# EAGLE design BEP2_rev1 seeed 55x88 (EAGLE 6.5.0)
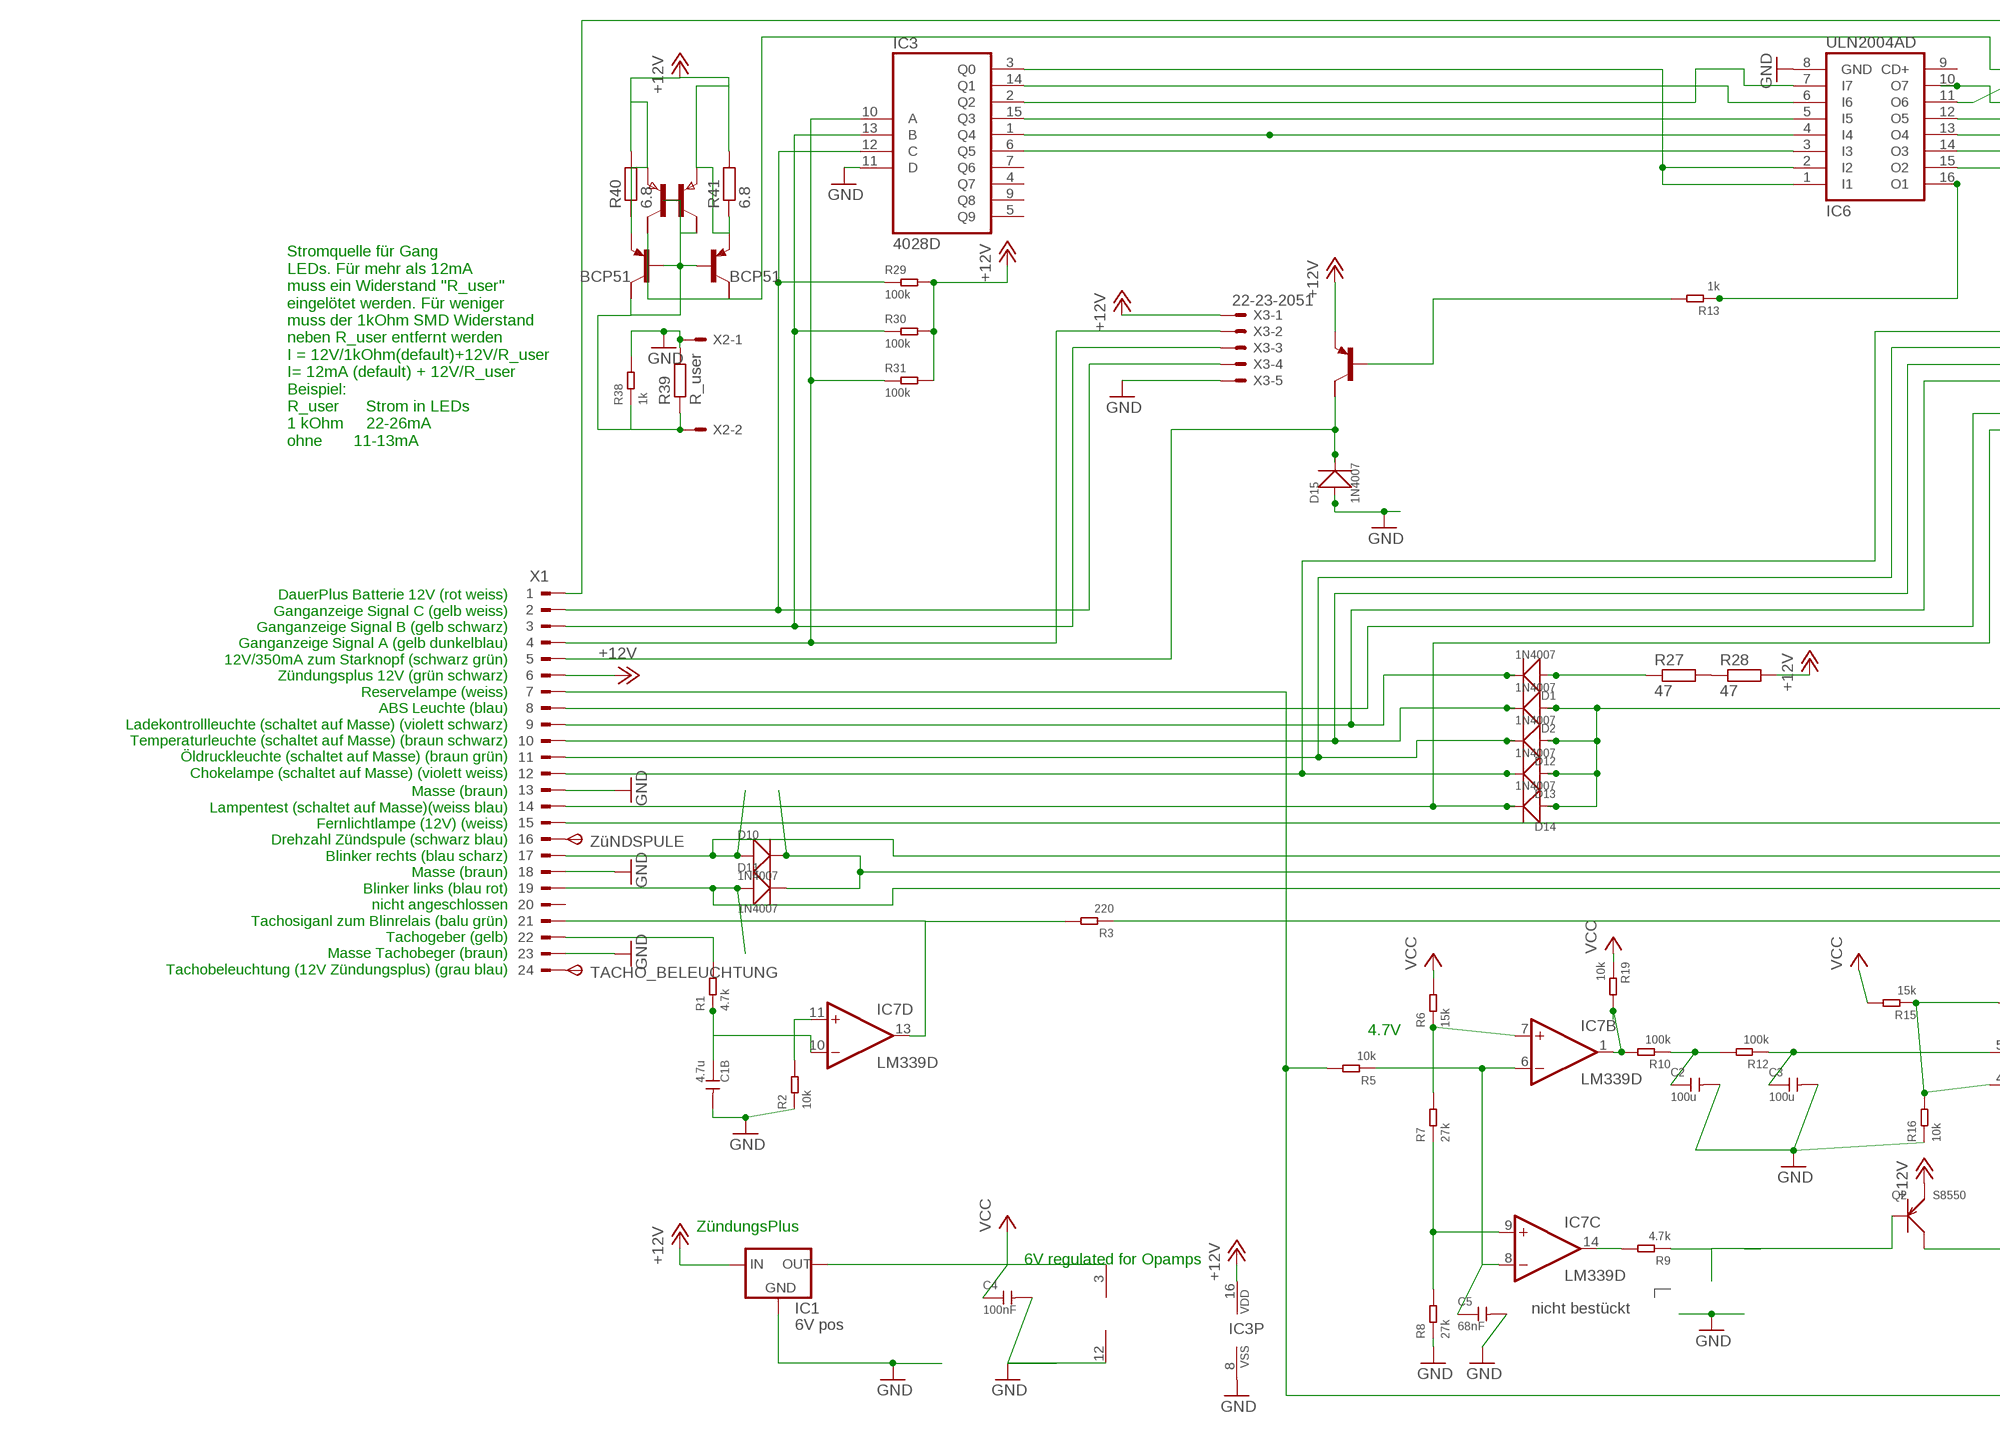
[diagram p0: schematic, sheet 1, part 1 of 2]
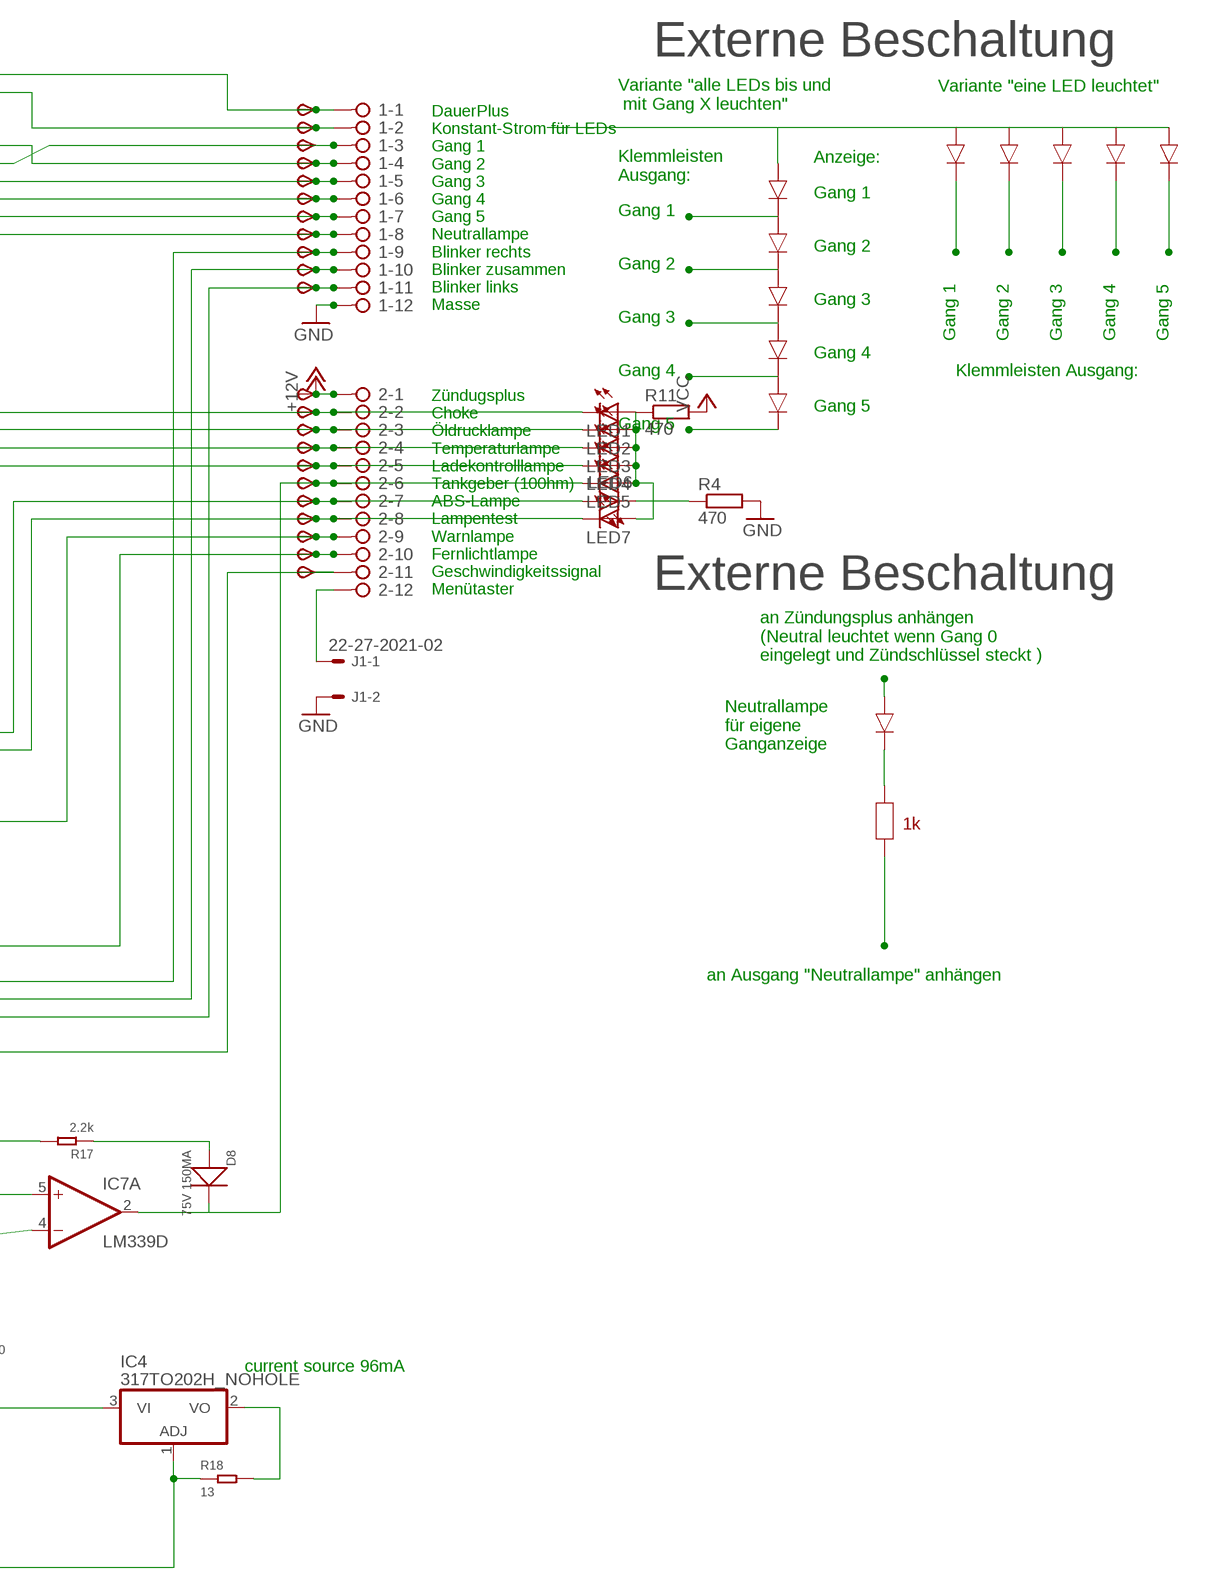
[diagram p1: schematic, sheet 1, part 2 of 2]

## Parts
1  2081-1132  [12-PIN]
2  2081-1132  [12-PIN]
C1B  4.7u  CERAMIC-4.7UF-25V-10%-X5R(0805)  [C0805]
C2  100u  CERAMIC-100UF-6.3V-20%-X5R(1206)  [C1206]
C3  100u  CERAMIC-100UF-6.3V-20%-X5R(1206)  [C1206]
C4  100nF  CERAMIC-100NF-50V-10%-X7R(0805)  [C0805]
C5  68nF  CERAMIC-100NF-50V-10%-X7R(0805)  [C0805]
D1  1N4007  DIODE-GEN-PURPOSE-1KV-1A(DO-214AC)  [DO-214AC]
D2  1N4007  DIODE-GEN-PURPOSE-1KV-1A(DO-214AC)  [DO-214AC]
D8  75V 150MA  SMD-DIODE-SWITCHING-75V-150MA(D1206)  [LED-1206]
D10  1N4007  DIODE-GEN-PURPOSE-1KV-1A(DO-214AC)  [DO-214AC]
D11  1N4007  DIODE-GEN-PURPOSE-1KV-1A(DO-214AC)  [DO-214AC]
D12  1N4007  DIODE-GEN-PURPOSE-1KV-1A(DO-214AC)  [DO-214AC]
D13  1N4007  DIODE-GEN-PURPOSE-1KV-1A(DO-214AC)  [DO-214AC]
D14  1N4007  DIODE-GEN-PURPOSE-1KV-1A(DO-214AC)  [DO-214AC]
D15  1N4007  DIODE-GEN-PURPOSE-1KV-1A(DO-214AC)  [DO-214AC]
IC1  6V pos  78LXX  [78LXX]
IC3  4028D  [SO16]
IC4  317TO202H_NOHOLE  [TO220H_NOHOLE]
IC6  ULN2004AD  [SO16]
IC7  LM339D  [SO14]
J1  22-27-2021-02  [6410-02]
LED1  LEDLD260  [LD260]
LED2  LEDLD260  [LD260]
LED3  LEDLD260  [LD260]
LED4  LEDLD260  [LD260]
LED5  LEDLD260  [LD260]
LED6  LEDLD260  [LD260]
LED7  LEDLD260  [LD260]
Q2  S8550  SMD-TRANSISTORS-PNP-25V-500MA-S8550(SOT-23)  [SOT-23]
Q3  BCP53T1  [SOT223]
R1  4.7k  SMD-RES-4.7K-5%-1/8W(0805)  [R0805]
R2  10k  SMD-RES-10K-1%-1/8W(0805)  [R0805]
R3  220  SMD-RES-220R-5%-1/8W(0805)  [R0805]
R4  470  R-EU_R0805  [R0805]
R5  10k  SMD-RES-10K-1%-1/8W(0805)  [R0805]
R6  15k  SMD-RES-10K-1%-1/8W(0805)  [R0805]
R7  27k  SMD-RES-18K-5%-1/10W(0603)  [R0603]
R8  27k  SMD-RES-18K-5%-1/10W(0603)  [R0603]
R9  4.7k  SMD-RES-4.7K-5%-1/8W(0805)  [R0805]
R10  100k  SMD-RES-100K-1%-1/10W(0603)  [R0603]
R11  470  R-EU_R0805  [R0805]
R12  100k  SMD-RES-100K-1%-1/10W(0603)  [R0603]
R13  1k  SMD-RES-1K-5%-1/8W(0805)  [R0805]
R15  15k  SMD-RES-15K-1%-1/10W(0603)  [R0603]
R16  10k  SMD-RES-10K-1%-1/8W(0805)  [R0805]
R17  2.2k  SMD-RES-2.2K-5%-1/8W(0805)  [R0805]
R18  13  SMD-RES-13R-5%-1/4W(1206)  [R1206]
R19  10k  SMD-RES-10K-1%-1/8W(0805)  [R0805]
R27  47  R-EU_V235/17_1MM  [V235/17_1MM]
R28  47  R-EU_V235/17_1MM  [V235/17_1MM]
R29  100k  SMD-RES-100K-1%-1/10W(0603)  [R0603]
R30  100k  SMD-RES-100K-1%-1/10W(0603)  [R0603]
R31  100k  SMD-RES-100K-1%-1/10W(0603)  [R0603]
R38  1k  SMD-RES-1K-5%-1/8W(0805)  [R0805]
R39  R_user  R-EU_R0805  [R0805]
R40  6.8  R-EU_R0805  [R0805]
R41  6.8  R-EU_R0805  [R0805]
T1  PNP2SM8  [SM8]
T13  BCP53T1  [SOT223]
T14  BCP53T1  [SOT223]
TACHO_BELEUCHTUNG  TPSP1_1MM  [P1_1.0MM]
TP1  TPSB1,27  [B1,27]
TP2  TPSB1,27  [B1,27]
TP3  TPSB1,27  [B1,27]
TP4  TPSB1,27  [B1,27]
TP5  TPSB1,27  [B1,27]
TP6  TPSB1,27  [B1,27]
TP7  TPSB1,27  [B1,27]
TP8  TPSB1,27  [B1,27]
TP9  TPSB1,27  [B1,27]
TP10  TPSB1,27  [B1,27]
TP11  TPSB1,27  [B1,27]
TP12  TPSB1,27  [B1,27]
TP16  TPSB1,27  [B1,27]
TP17  TPSB1,27  [B1,27]
TP18  TPSB1,27  [B1,27]
TP19  TPSB1,27  [B1,27]
TP21  TPSB1,27  [B1,27]
TP22  TPSB1,27  [B1,27]
TP23  TPSB1,27  [B1,27]
TP24  TPSB1,27  [B1,27]
TP25  TPSB1,27  [B1,27]
TP26  TPSB1,27  [B1,27]
X1  CON_BMW  [24-PIN]
X2  22-23-2021  [22-23-2021]
X3  22-23-2051  [22-23-2051]
ZüNDSPULE  TPSP1_1MM  [P1_1.0MM]

## Nets
+12V: 2.1 IC1.IN IC3.16(VDD) Q2.2(E) Q3.3(E) R28.2 R29.2 R30.2 R31.2 R40.1 R40.2 R41.1 R41.2 T1.1(B:E) T1.3(A:E) T13.3(E) T14.3(E) TP12.TP(PP) X1.6 X3.1
GND: 1.12 C1B.2 C2.2 C3.2 C4.2 C5.2 D15.1(+) IC1.GND IC3.8(VSS) IC3.11(D) IC6.8(GND) IC7.12(P:GND) J1.2 R2.1 R4.2 R8.1 R16.1 R38.2 R39.2 X1.13 X1.18 X1.23 X2.1 X3.5
N$1: 2.9 D2.1(+) D12.1(+) D13.1(+) D14.1(+) TP24.TP(PP)
N$2: IC3.10(A) R31.1 X1.4 X3.2
N$3: IC3.13(B) R30.1 X1.3 X3.3
N$4: 2.7 LED6.A TP22.TP(PP) X1.8
N$6: IC6.16(O1) R13.1
N$7: IC7.11(D:+IN) R2.2
N$8: R27.2 R28.1
N$11: D15.2(-) Q3.2(C) X1.5
N$12: 2.2 D13.2(-) LED1.K(C) TP16.TP(PP) X1.12
N$13: 2.3 D12.2(-) LED2.K(C) TP17.TP(PP) X1.11
N$14: 2.4 D2.2(-) LED3.K(C) TP18.TP(PP) X1.10
N$15: IC4.1(ADJ) R5.2 R18.1 X1.7
N$16: C5.1 IC7.6(B:-IN) IC7.8(C:-IN) R5.1
N$17: IC3.12(C) R29.1 X1.2 X3.4
N$18: IC3.15(Q3) IC6.5(I5)
N$19: 2.8 D14.2(-) LED7.K(C) TP23.TP(PP) X1.14
N$20: 1.9 D10.1(+) TP9.TP(PP) X1.17
N$21: 1.11 D11.1(+) TP11.TP(PP) X1.19
N$22: 1.10 D10.2(-) D11.2(-) TP10.TP(PP)
N$23: R1.2 X1.22
N$24: C1B.1 IC7.10(D:-IN) R1.1
N$25: 1.6 IC6.13(O4) TP6.TP(PP)
N$26: 1.7 IC6.14(O3) TP7.TP(PP)
N$27: 2.11 R3.1 TP26.TP(PP)
N$28: 2.12 J1.1
N$29: IC4.2(VO) R18.2
N$30: IC7.9(C:+IN) R7.1 R8.2
N$31: IC7.14(C:OUT) R9.2
N$34: LED6.K(C) R4.1
N$35: IC4.3(VI) Q2.3(C)
N$36: Q2.1(B) R9.1
N$37: IC3.2(Q2) IC6.7(I7)
N$38: 1.3 IC6.11(O6) TP3.TP(PP)
N$39: 1.5 IC6.12(O5) TP5.TP(PP)
N$40: IC7.7(B:+IN) R6.1 R7.2
N$41: LED1.A LED2.A LED3.A LED4.A LED5.A LED7.A R11.1
N$42: X1.16 ZüNDSPULE.TP(PP)
N$43: Q3.1(B) R13.2
N$44: IC3.3(Q0) IC6.1(I1) IC6.2(I2)
N$45: C2.1 R10.1 R12.2
N$46: C3.1 IC7.5(A:+IN) R12.1
N$47: IC7.4(A:-IN) R15.1 R16.2 R17.2
N$48: IC7.13(D:OUT) R3.2 X1.21
N$49: D8.+ R17.1
N$50: IC3.1(Q4) IC6.4(I4)
N$52: 1.8 IC6.15(O2) TP8.TP(PP)
N$53: 2.10 TP25.TP(PP) X1.15
N$54: D1.1(+) R27.1
N$55: 2.5 D1.2(-) LED4.K(C) TP19.TP(PP) X1.9
N$56: IC3.14(Q1) IC6.6(I6)
N$57: R38.1 R39.1 T1.2(B:B) T1.4(A:B) T1.6(A:C1) T13.1(B) T13.2(C) T14.1(B) X2.2
N$58: TACHO_BELEUCHTUNG.TP(PP) X1.24
N$59: 1.2 T1.8(B:C1) T14.2(C) TP2.TP(PP)
N$60: 2.6 D8.- IC7.2(A:OUT) LED5.K(C) TP21.TP(PP)
N$61: IC3.6(Q5) IC6.3(I3)
N$67: 1.4 IC6.10(O7) TP4.TP(PP)
N$69: 1.1 TP1.TP(PP) X1.1
N$580: IC7.1(B:OUT) R10.2 R19.2
VCC: C4.1 IC1.OUT IC7.3(P:V+) R6.2 R11.2 R15.2 R19.1
Unconnected: IC3.4(Q7) IC3.5(Q9) IC3.7(Q6) IC3.9(Q8) IC6.9(CD+) Q3.4(C/) T1.5(A:C) T1.7(B:C) T13.4(C/) T14.4(C/) X1.20

## Notes on the sheet
- Externe Beschaltung
- Variante "eine LED leuchtet"
- Variante "alle LEDs bis und
   mit Gang X leuchten"
- Anzeige:
- Klemmleisten
  Ausgang:
- Gang 1
- DauerPlus
  Konstant-Strom für LEDs
  Gang 1
  Gang 2
  Gang 3
  Gang 4
  Gang 5
  Neutrallampe
  Blinker rechts
  Blinker zusammen
  Blinker links
  Masse
- Gang 1
- Gang 2
- Gang 2
- Gang 3
- Gang 3
- Gang 1 | Gang 2 | Gang 3 | Gang 4 | Gang 5
- Gang 4
- Gang 4 | Klemmleisten Ausgang:
- Gang 5
- Gang 5
- Zündugsplus
  Choke
  Öldrucklampe
  Temperaturlampe
  Ladekontrolllampe
  Tankgeber (100hm)
  ABS-Lampe
  Lampentest
  Warnlampe
  Fernlichtlampe
  Geschwindigkeitssignal
  Menütaster
- Stromquelle für Gang
  LEDs. Für mehr als 12mA
  muss ein Widerstand "R_user"
  eingelötet werden. Für weniger
  muss der 1kOhm SMD Widerstand
  neben R_user entfernt werden
  I = 12V/1kOhm(default)+12V/R_user
  I= 12mA (default) + 12V/R_user
  Beispiel:
  R_user      Strom in LEDs
  1 kOhm     22-26mA
  ohne       11-13mA
- Externe Beschaltung
- an Zündungsplus anhängen
  (Neutral leuchtet wenn Gang 0
  eingelegt und Zündschlüssel steckt )
- Neutrallampe
  für eigene
  Ganganzeige
- DauerPlus Batterie 12V (rot weiss)
  Ganganzeige Signal C (gelb weiss)
  Ganganzeige Signal B (gelb schwarz)
  Ganganzeige Signal A (gelb dunkelblau)
  12V/350mA zum Starknopf (schwarz grün)
  Zündungsplus 12V (grün schwarz)
  Reservelampe (weiss)
  ABS Leuchte (blau)
  Ladekontrollleuchte (schaltet auf Masse) (violett schwarz)
  Temperaturleuchte (schaltet auf Masse) (braun schwarz)
  Öldruckleuchte (schaltet auf Masse) (braun grün)
  Chokelampe (schaltet auf Masse) (violett weiss)
- 1k
- an Ausgang "Neutrallampe" anhängen
- Masse (braun)
  Lampentest (schaltet auf Masse)(weiss blau)
  Fernlichtlampe (12V) (weiss)
  Drehzahl Zündspule (schwarz blau)
  Blinker rechts (blau scharz)
  Masse (braun)
  Blinker links (blau rot)
  nicht angeschlossen
  Tachosiganl zum Blinrelais (balu grün)
  Tachogeber (gelb)
  Masse Tachobeger (braun)
  Tachobeleuchtung (12V Zündungsplus) (grau blau)
- 4.7V
- current source 96mA
- ZündungsPlus
- 6V regulated for Opamps
- nicht bestückt

## Library data of the parts
1 2 = con WAGO BMW:2081-1132: WAGO SREW CLAMP
C1B = Seeed-Capacitor-2016:CERAMIC-4.7UF-25V-10%-X5R(0805): 302010146; MPN: CC0805KKX5R8BB475; VALUE: 4.7uf
C2 C3 = Seeed-Capacitor-2016:CERAMIC-100UF-6.3V-20%-X5R(1206): 302010183; MPN: GRM31CR60J107ME39L; VALUE: 100uf
C4 C5 = Seeed-Capacitor-2016:CERAMIC-100NF-50V-10%-X7R(0805): 302010165; MPN: CC0805KRX7R9BB104; VALUE: 100nf
D1 D2 D10-D15 = Seeed-Diode-2016:DIODE-GEN-PURPOSE-1KV-1A(DO-214AC): 304010013; MPN: 1N4007
D8 = Seeed-Diode-2016:SMD-DIODE-SWITCHING-75V-150MA(D1206): 304040005; MPN: CD1206-S01575
IC1 = v-reg:78LXX: VOLTAGE REGULATOR
IC3 = 40xx:4028: BCD to decimal DECODER
IC4 = linear_BMW:*317: Positive VOLTAGE REGULATOR
IC6 = uln-udn:ULN2004A: DRIVER ARRAY
IC7 = linear:LM339: Low Power Low Offset Voltage Quad Comparators with open collector; LM139/LM239/LM339/LM2901/LM3302
J1 = con-molex:22-?-02: CONNECTOR wire to board 2.54 mm (.1 inch) pitch header; OC_FARNELL: unknown; OC_NEWARK: unknown
LED1-LED7 = led:LED: LED OSRAM: - CHIPLED LG R971, LG N971, LY N971, LG Q971, LY Q971, LO R971, LY R971 LH N974, LH R974 LS Q976, LO Q976, LY Q976 LO Q996 - Hyper CHIPLED LW Q18S LB Q993, LB Q99A, LB R99A - SideLED LS A670, LO A670, LY A670, LG A670, LP A670 LB A673, LV A673, LT A673, LW A673 LH A674 LY A675 LS A676, LA A676, LO A676, LY A676, LW A676 LS A679, LY A679, LG A679 - Hyper Micro SIDELED® LS Y876, LA Y876, LO Y876, LY Y876 LT Y87S - SmartLED LW L88C, LW L88S LB L89C, LB L89S, LG L890 LS L89K, LO L89K, LY L89K LS L896, LA L896, LO L896, LY L896 - TOPLED LS T670, LO T670, LY T670, LG T670, LP T670 LSG T670, LSP T670, LSY T670, LOP T670, LYG T670 LG T671, LOG T671, LSG T671 LB T673, LV T673, LT T673, LW T673 LH T674 LS T676, LA T676, LO T676, LY T676, LB T676, LH T676, LSB T676, LW T676 LB T67C, LV T67C, LT T67C, LS T67K, LO T67K, LY T67K, LW E67C LS E67B, LA E67B, LO E67B, LY E67B, LB E67C, LV E67C, LT E67C LW T67C LS T679, LY T679, LG T679 LS T770, LO T770, LY T770, LG T770, LP T770 LB T773, LV T773, LT T773, LW T773 LH T774 LS E675, LA E675, LY E675, LS T675 LS T776, LA T776, LO T776, LY T776, LB T776 LHGB T686 LT T68C, LB T68C - Hyper Mini TOPLED® LB M676 - Mini TOPLED Santana® LG M470 LS M47K, LO M47K, LY M47K Source: http://www.osram.convergy.de LUXEON: - LUMILED® LXK2-PW12-R00, LXK2-PW12-S00, LXK2-PW14-U00, LXK2-PW14-V00 LXK2-PM12-R00, LXK2-PM12-S00, LXK2-PM14-U00 LXK2-PE12-Q00, LXK2-PE12-R00, LXK2-PE12-S00, LXK2-PE14-T00, LXK2-PE14-U00 LXK2-PB12-K00, LXK2-PB12-L00, LXK2-PB12-M00, LXK2-PB14-N00, LXK2-PB14-P00, LXK2-PB14-Q00 LXK2-PR12-L00, LXK2-PR12-M00, LXK2-PR14-Q00, LXK2-PR14-R00 LXK2-PD12-Q00, LXK2-PD12-R00, LXK2-PD12-S00 LXK2-PH12-R00, LXK2-PH12-S00 LXK2-PL12-P00, LXK2-PL12-Q00, LXK2-PL12-R00 Source: www.luxeon.com KINGBRIGHT: KA-3528ASYC Source: www.kingbright.com
Q2 = Seeed-Transistor-2016:SMD-TRANSISTORS-PNP-25V-500MA-S8550(SOT-23): 305020006; MPN: S8550
Q3 = BCP53_:BCP53*
R1 R9 = Seeed-Resistor-2016:SMD-RES-4.7K-5%-1/8W(0805): 301010306; MPN: RC0805JR-074K7L; VALUE: 4.7K
R2 R5 R6 R16 R19 = Seeed-Resistor-2016:SMD-RES-10K-1%-1/8W(0805): 301010361; MPN: RC0805FR-0710KL; VALUE: 10K
R3 = Seeed-Resistor-2016:SMD-RES-220R-5%-1/8W(0805): 301010315; MPN: RC0805JR-07220RL; VALUE: 220R
R4 R11 R27 R28 R39-R41 = rcl:R-EU_: RESISTOR, European symbol
R7 R8 = Seeed-Resistor-2016:SMD-RES-18K-5%-1/10W(0603): 301010104; MPN: RC0603JR-0718KL; VALUE: 18K 1/10W
R10 R12 R29-R31 = Seeed-Resistor-2016:SMD-RES-100K-1%-1/10W(0603): 301010196; MPN: RC0603FR-07100KL; VALUE: 100K
R13 R38 = Seeed-Resistor-2016:SMD-RES-1K-5%-1/8W(0805): 301010311; MPN: RC0805JR-071KL; VALUE: 1K
R15 = Seeed-Resistor-2016:SMD-RES-15K-1%-1/10W(0603): 301010241; MPN: RC0603FR-0715KL; VALUE: 15K 1/10W
R17 = Seeed-Resistor-2016:SMD-RES-2.2K-5%-1/8W(0805): 301010333; MPN: RC0805JR-072K2L; VALUE: 2.2K
R18 = Seeed-Resistor-2016:SMD-RES-13R-5%-1/4W(1206): 301010405; MPN: RC1206JR-0713RL; VALUE: 13R
T1 = PNP2SM8:PNP2SM8; OC_FARNELL: unknown; OC_NEWARK: unknown
T13 T14 = BCP53_:BCP53*; T: BCP51
TACHO_BELEUCHTUNG TP1-TP12 TP16-TP19 TP21-TP26 ZüNDSPULE = testpin_BMW:TPS: TEST PIN
X1 = con_BMW:CON_BMW: BMW CONNECTOR
X2 = con-molex:22-23-2021: .100" (2.54mm) Center Header - 2 Pin; MF: MOLEX; MPN: 22-23-2021; OC_FARNELL: 1462926; OC_NEWARK: 25C3832
X3 = con-molex:22-23-2051: .100" (2.54mm) Center Header - 5 Pin; MF: MOLEX; MPN: 22-23-2051; OC_FARNELL: 1462952; OC_NEWARK: 38C9178

## Board
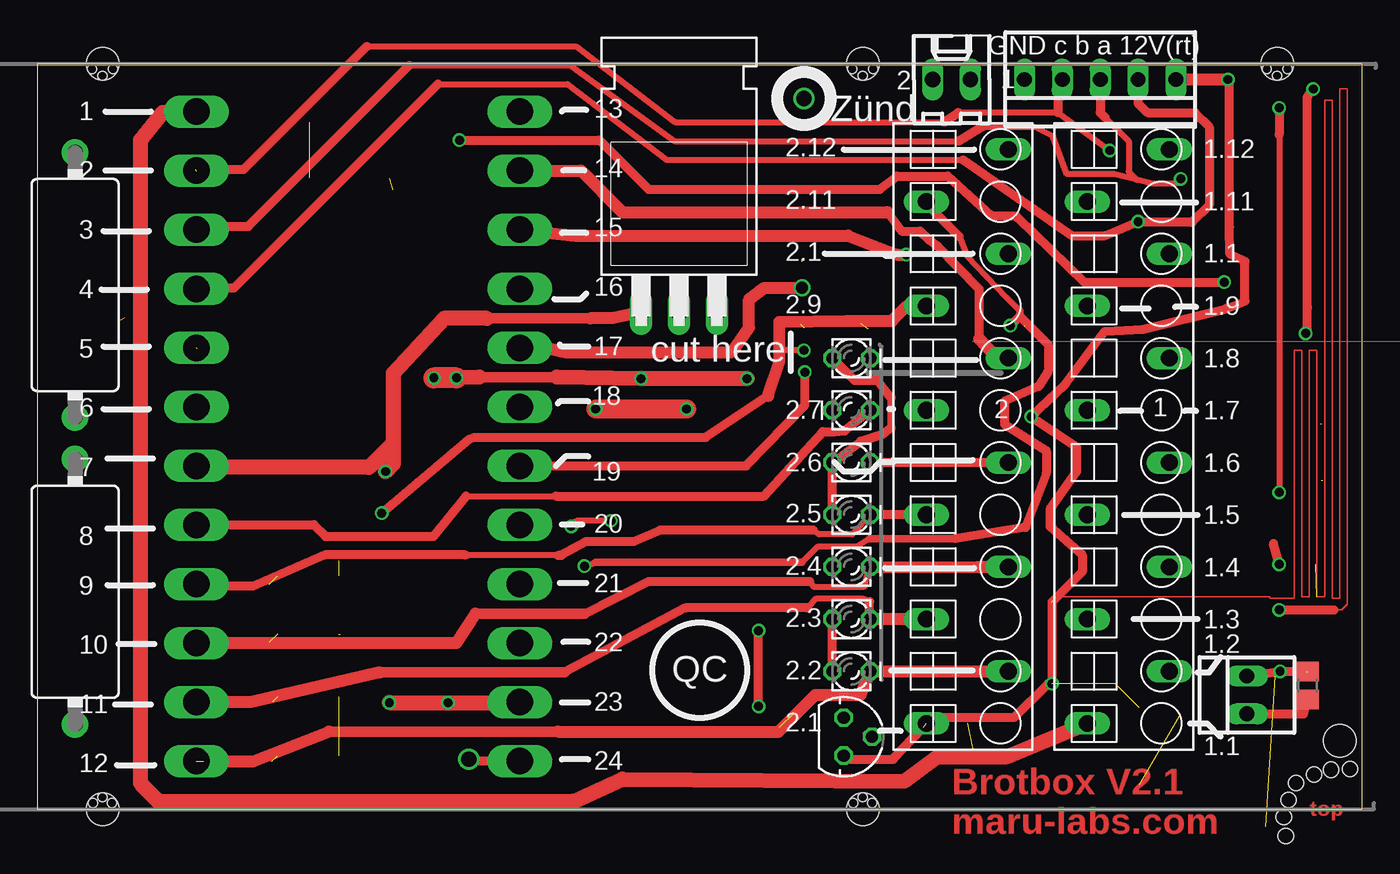
[diagram p2: board, top side]
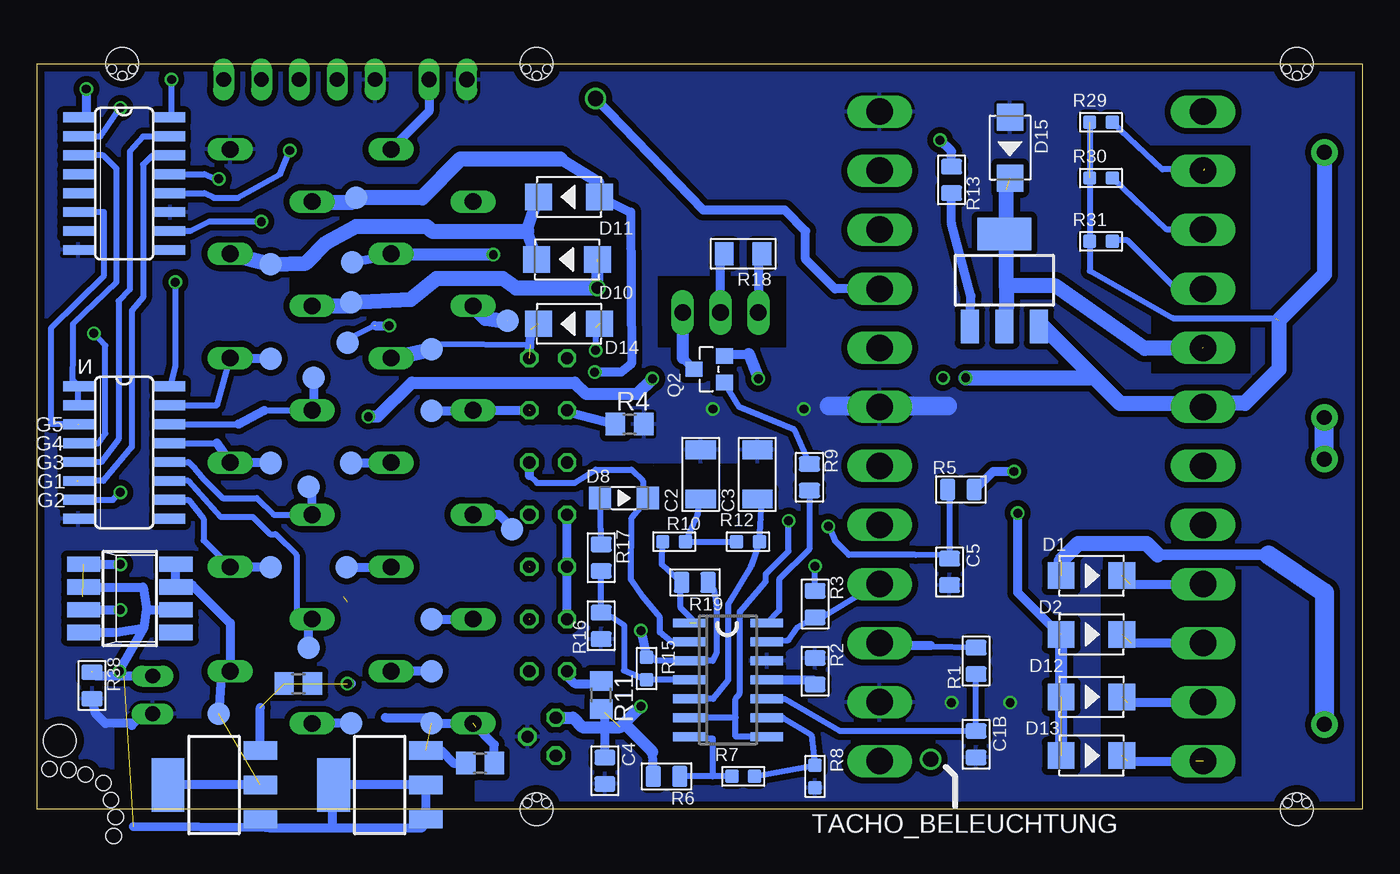
[diagram p3: board, bottom side, seen from below]

Size 88.89 x 50 mm. Coordinates in mm from the lower left corner, seen from the top.
Outline: 0,0 88.89,0 88.89,50 0,50 0,0
Copper layers (1*16): Top 0.035mm / dielectric 1.5mm / Bottom 0.035mm
Design rules "multi-cb_035um-cu *": minimum track width 6mil, minimum drill 12mil, track to track 16mil, track to pad 20mil, pad to pad 16mil, via to via 16mil, smd to smd 16mil, copper to edge 20mil, drill to drill 8mil, minimum pad ring 8mil, minimum via ring 6mil, stop-mask expansion 3mil, vias tented up to drill 0mil, thermal gap 8mil
Holes 2.18 mm at 4.39,50 55.39,50 4.39,0 55.39,0 83.19,50 87.39,4.6
Holes 1.02 mm at 88.07,2.71 86.8,2.64 85.66,2.33 83.95,0.61 83.63,-0.53 83.76,-1.8 84.45,1.75
Holes 0.6 mm at 55.37,0.8 54.74,0.42 56.01,0.42 4.38,0.8 3.75,0.42 5.02,0.42 4.38,49.19 3.68,49.63 5.08,49.63 55.37,49.19 54.67,49.63 56.07,49.63 83.19,49.19 82.49,49.63 83.88,49.63
bRestrict: area 7.5,29.3 to 14.2,44.5; area 53.7,25.8 to 55.6,28; area 38.7,31 to 47.2,35.7; area 59.6,-1.9 to 83.7,6.1; area 49.7,30.8 to 51.6,34.6; area 60.5,30.2 to 66.5,37.5; area 66.5,33.1 to 71.9,37.2; area 39.4,21.6 to 48.9,23.2; area 8.1,2.2 to 17.5,16

### Footprints (pad centres in the part's own frame; a part is rotated, then mirrored left to right if it is on the bottom)
12-PIN = drill 1.118 long: 1 19.25,-2.45; 2 15.75,3.05; 3 12.25,-2.45; 4 8.75,3.05; 5 5.25,-2.45; 6 1.75,3.05; 7 -1.75,-2.45; 8 -5.25,3.05; 9 -8.75,-2.45; 10 -12.25,3.05; 11 -15.75,-2.45; 12 -19.25,3.05
C0805 = smd 1.397 x 1.016: 1 0,0.889; 2 0,-0.889
C1206 = smd 1.27 x 2.032: 1 -1.651,0; 2 1.651,0
DO-214AC = smd 1.8 x 1.77: 1 -2.042,0; 2 2.042,0
LED-1206 = smd 1.5 x 1.5: + -1.6,0; - 1.6,0
78LXX = drill 0.813 octagon: GND 0,1.905; IN 1.27,0; OUT -1.27,0
SO16 = smd 0.66 x 2.032: 1 -4.445,-3.073; 2 -3.175,-3.073; 3 -1.905,-3.073; 4 -0.635,-3.073; 5 0.635,-3.073; 6 1.905,-3.073; 7 3.175,-3.073; 8 4.445,-3.073; 9 4.445,3.073; 10 3.175,3.073; 11 1.905,3.073; 12 0.635,3.073; 13 -0.635,3.073; 14 -1.905,3.073; 15 -3.175,3.073; 16 -4.445,3.073
TO220H_NOHOLE = drill 1.118 long: 1 -2.54,-10.16; 2 0,-10.16; 3 2.54,-10.16
SO14 = smd 0.6 x 2.2: 1 -3.81,-2.6; 2 -2.54,-2.6; 3 -1.27,-2.6; 4 0,-2.6; 5 1.27,-2.6; 6 2.54,-2.6; 7 3.81,-2.6; 8 3.81,2.6; 9 2.54,2.6; 10 1.27,2.6; 11 0,2.6; 12 -1.27,2.6; 13 -2.54,2.6; 14 -3.81,2.6
6410-02 = drill 1.016 long: 1 1.27,0; 2 -1.27,0
LD260 = drill 0.813 octagon: A -1.27,0; K 1.27,0
SOT-23 = smd 1.016 x 1.143: 1 -0.889,-1.016; 2 0.889,-1.016; 3 0,1.016
SOT223 = smd 1.219 x 2.235: 1 -2.311,-3.099; 2 0,-3.099; 3 2.311,-3.099 | smd 3.6 x 2.2: 4 0,3.099
R0805 = smd 1.397 x 1.016: 1 0,0.889; 2 0,-0.889
R0805' = smd 1.3 x 1.5: 1 -0.95,0; 2 0.95,0
R0603 = smd 0.889 x 0.889: 1 0,0.762; 2 0,-0.762
R1206 = smd 1.27 x 1.524: 1 -1.27,0; 2 1.27,0
V235/17_1MM = drill 1 pad 1.778: 1 -8.89,0; 2 8.89,0
SM8 = smd 1.016 x 2.235: 1 -2.286,-3.099; 2 -0.762,-3.099; 3 0.762,-3.099; 4 2.286,-3.099; 5 2.286,3.099; 6 0.762,3.099; 7 -0.762,3.099; 8 -2.286,3.099
P1_1.0MM = drill 1.016: TP 0,0
B1,27 = smd 1.5 x 1.5: TP 0,0
24-PIN = drill 1.778 long: 1 -21.78,-10.85; 2 -17.82,-10.85; 3 -13.86,-10.85; 4 -9.9,-10.85; 5 -5.94,-10.85; 6 -1.98,-10.85; 7 1.98,-10.85; 8 5.94,-10.85; 9 9.9,-10.85; 10 13.86,-10.85; 11 17.82,-10.85; 12 21.78,-10.85; 13 -21.78,10.85; 14 -17.82,10.85; 15 -13.86,10.85; 16 -9.9,10.85; 17 -5.94,10.85; 18 -1.98,10.85; 19 1.98,10.85; 20 5.94,10.85; 21 9.9,10.85; 22 13.86,10.85; 23 17.82,10.85; 24 21.78,10.85
22-23-2021 = drill 1 long: 1 -1.27,0; 2 1.27,0
22-23-2051 = drill 1 long: 1 -5.08,0; 2 -2.54,0; 3 0,0; 4 2.54,0; 5 5.08,0

### Placement (x,y rotation side)
1  72.9,25 270 top
2  62.1,25 270 top
C1B  25.91,4.36 0 bottom
C2  44.39,22.46 90 bottom
C3  40.58,22.46 90 bottom
C4  50.8,2.58 0 bottom
C5  27.69,15.91 0 bottom
D1  18.16,15.66 0 bottom
D2  18.16,11.72 0 bottom
D8  49.53,20.87 0 bottom
D10  53.34,36.87 180 bottom
D11  53.21,41.06 180 bottom
D12  18.16,7.53 0 bottom
D13  18.16,3.6 0 bottom
D14  53.21,32.55 180 bottom
D15  23.62,44.36 270 bottom
IC1  54.1,4.87 270 top
IC3  83.06,41.95 270 bottom
IC4  43.05,43.47 0 top
IC6  83.06,23.92 270 bottom
IC7  42.54,8.68 270 bottom
J1  61.34,48.94 0 top
LED1  54.61,9.25 0 top
LED2  54.61,12.75 0 top
LED3  54.61,16.25 0 top
LED4  54.61,19.75 0 top
LED5  54.61,23.25 0 top
LED6  54.61,26.75 180 top
LED7  54.61,30.25 0 top
Q2  43.81,29.5 90 bottom
Q3  24,35.47 0 bottom
R1  25.91,9.95 180 bottom
R2  36.7,9.25 0 bottom
R3  36.7,13.76 0 bottom
R4  470  [R0805']  49.15,25.82 0 bottom
R5  26.92,21.44 90 bottom
R6  46.67,2.2 270 bottom
R7  41.53,2.2 270 bottom
R8  36.7,2.2 180 bottom
R9  37.08,22.27 0 bottom
R10  46.16,17.95 270 bottom
R11  470  [R0805']  51.05,7.66 270 bottom
R12  41.21,17.95 270 bottom
R13  27.56,42.2 0 bottom
R15  48.01,9.44 180 bottom
R16  51.05,12.3 180 bottom
R17  51.05,16.87 0 bottom
R18  41.53,37.25 180 bottom
R19  44.77,15.22 270 bottom
R27  2.54,14.58 90 top
R28  2.54,35.16 90 top
R29  17.53,46.08 270 bottom
R30  17.53,42.33 270 bottom
R31  17.53,38.08 270 bottom
R38  85.22,8.29 0 bottom
R39  R_user  [R0805']  85.22,8.29 270 top
R40  6.8  [R0805']  59.18,3.09 0 bottom
R41  6.8  [R0805']  71.37,8.42 0 bottom
T1  82.68,14.14 270 bottom
T13  65.91,1.63 90 bottom
T14  77.03,1.63 90 bottom
TACHO_BELEUCHTUNG  28.96,3.34 0 bottom
TP1  67.82,5.76 0 bottom
TP2  76.71,6.39 0 bottom
TP3  70.68,10.84 0 bottom
TP4  73.22,16.23 0 bottom
TP5  70.68,21.63 0 bottom
TP6  73.22,23.22 0 bottom
TP7  70.36,28.93 0 bottom
TP8  73.22,30.2 0 bottom
TP9  67.82,34.01 0 bottom
TP10  73.22,36.55 0 bottom
TP11  67.5,41 0 bottom
TP12  62.42,5.76 0 bottom
TP16  62.42,9.25 0 bottom
TP17  62.42,12.74 0 bottom
TP18  68.14,16.23 0 bottom
TP19  57.02,18.77 0 bottom
TP21  67.82,23.22 0 bottom
TP22  62.42,26.71 0 bottom
TP23  62.42,30.84 0 bottom
TP24  57.34,32.74 0 bottom
TP25  67.75,36.68 0 bottom
TP26  68.07,31.28 0 bottom
X1  21.52,25 270 top
X2  81.15,7.66 90 top
X3  71.31,48.94 180 top
ZüNDSPULE  51.43,47.66 0 bottom

### Tracks (layer width: path | path; a pad name or v marks a point on that pad's centre or on a via)
+12V  (via drill 0.6)  (9 unrouted)
  Top 0.1: v83.31,13.38 87.5,13.38 87.88,13.76 87.88,48.3 87.38,48.3 87.38,14.14 86.87,14.14 86.87,47.54 86.36,47.54 86.36,14.26 85.85,14.26 85.85,30.77 85.34,30.77 85.34,14.26 84.84,14.26 84.84,30.77 84.33,30.77 84.33,14.14 82.68,14.14 82.68,14.26 68.33,14.26
  Top 0.406: IC1.IN 54.36,3.6 54.61,3.34 | 59.44,5.5 59.4,5.5
  Top 0.61: v79.88,48.94 79.98,48.83 79.98,39.03 80.01,37.23 81.03,36.74 81.03,34.08 79.76,33.57 74.17,32.17 71.63,32.04 68.96,28.49 v66.68,26.33 69.72,24.3 69.72,22.65 67.95,20.11 67.95,18.96 70.1,17.06 70.1,15.91 68.07,13.88 v68.07,8.42 67.82,8.42 65.53,6.14 60.04,6.14 2.1 | 54.61,3.34 57.4,3.34 59.44,5.5 | v40.51,28.87 39.75,28.87 | v83.31,16.42 82.93,17.82 | v83.31,13.38 87,13.38
  Top 0.711: 34.86,28.97 29.66,28.97
  Top 0.813: v79.88,48.94 X3.1
  Top 1.016: v47.62,28.87 v40.51,28.87 34.86,28.97 | 29.66,28.97 v28.13,28.93
  Top 1.422: v28.13,28.93 v26.61,28.93
  Bottom 0.406: IC3.16 79.88,46.4 v79.88,48.94 | R29.2 R31.2 18.29,36.11 12.7,32.93 5.84,32.93
  Bottom 0.61: R40.2 58.23,4.33 2.1 TP12.TP 62.8,6.14 65.53,6.14 | v68.07,8.42 67.82,8.42 | Q2.2 42.67,30.52 41.15,30.52 | T13.3 61.81,3.94 60.96,3.09 R40.1 | T1.1 v83.31,16.42 | T14.3 73.93,6.82 | T1.3 v83.31,13.38
  Bottom 0.813: v66.68,26.33 66.04,26.33 63.75,28.61 52.83,28.61 52.07,27.85 48.64,27.85 v47.62,28.87 | 41.15,30.52 v40.51,28.87
  Bottom 1.016: R28.2 2.54,35.85 5.59,32.81 5.59,29.5 7.87,27.22 10.44,27.22 X1.6 10.94,27.22 16.26,27.22 17.97,28.93 | v26.61,28.93 17.97,28.93 | Q3.3 21.41,32.37 17.97,28.93
GND  (via drill 0.6)
  Top 0.61: X2.1 84.96,6.39 R39.2
  Top 1.27: v43.56,26.84 v37.46,26.84
  Bottom 0.61: 82.42,5.76 84.33,5.76 84.96,6.39 R38.2
  Bottom 1.27: 27.81,27.03 35.75,27.03
  other vias: 23.62,7.15 27.56,7.15
  pour Bottom: 0,52.74 88.77,52.74 88.77,-2.5 0,-2.5
  pour Bottom: 0,52.87 88.77,52.87 88.77,-2.37 0,-2.37
N$1  (via drill 0.6)  (4 unrouted)
  Top 0.406: v51.43,30.77 49.91,30.77 49.78,30.01
  Top 0.61: v23.11,19.85 28.96,24.8 29.34,24.93 44.83,24.93 49.02,27.73
  Top 0.813: 49.02,27.73 49.78,30.01 49.78,32.68 54.29,32.74 TP24.TP 58.35,33.75 2.9
  Bottom 0.406: 51.43,32.28 v51.43,30.77
  Bottom 0.61: 20.32,11.72 23.11,14.52 v23.11,19.85
  Bottom 0.813: D2.1 D13.1
  Bottom 1.016: 57.66,32.74 58.79,32.92 58.82,32.92 2.9
N$2  (via drill 0.6)
  Top 0.406: 26.86,48.62 35.56,48.62 42.23,43.54 62.1,43.54
  Top 0.61: X1.4 10.74,34.97 13.21,34.97 26.86,48.62 | 62.1,43.54 69.41,38.46 71.63,38.46 v73.85,39.41 73.91,39.35 77.47,39.35 78.61,40.49 78.61,45.76 77.66,46.71 74.48,46.71 73.85,47.35 X3.2
  Bottom 0.406: v73.85,39.41 77.34,39.41 78.61,38.77 IC3.10 | X1.4 12.51,34.9 15.75,38.14 16.51,38.14 R31.1
N$3  (via drill 0.6)
  Top 0.406: 24.96,49.89 35.75,49.89 42.73,44.81 61.79,44.81 | 63.37,45.76 66.87,45.76 68.14,45.12 69.09,42.59 72.26,42.59 73.76,42.21 | v76.71,42.27 76.39,41.95 74.8,41.95 73.76,42.21 | 71.63,46.4 73.22,44.81 73.22,42.75 73.76,42.21
  Top 0.61: X1.3 10.9,39.09 14.16,39.09 24.96,49.89 | 61.79,44.81 63.37,45.76 | X3.3 71.31,46.71 71.63,46.4
  Bottom 0.406: IC3.13 77.66,42.59 77.03,42.27 v76.71,42.27 | X1.3 13.1,38.86 R30.1
N$4  (1 unrouted)
  Top 0.406: 28.77,21 34.8,21
  Top 0.61: X1.8 18.54,19.09 19.33,18.3 26.58,18.3 28.77,21 | 34.8,21 48.77,21 52.7,25.31 53.47,25.31 54.17,25.38 55.82,26.71
  Bottom 0.61: TP22.TP 59.69,26.71 2.7 LED6.A
N$5
  Top 1.016: 23.62,7.15 32.51,7.15
N$6  (via drill 0.6)
  Top 0.61: v28.32,44.87 37.72,44.87 41.02,41.57 56.52,41.57 57.66,42.46 61.09,42.46 64.01,39.79 65.66,39.79 65.79,39.66 70.23,35.35 v79.63,35.35
  Bottom 0.406: v79.63,35.35 79.63,29.73 IC6.16
  Bottom 0.61: R13.1 27.56,44.11 v28.32,44.87
N$7
  Bottom 0.61: IC7.11 36.83,8.68 R2.2
N$8
  Bottom 1.27: R27.2 R28.1
N$11  (2 unrouted)
  Bottom 1.016: 10.71,30.9 14.6,30.9 20.57,35.09 23.88,35.09 | 23.88,35.09 23.88,33.77 Q3.2 | 23.88,35.09 23.88,41.55
N$12  (2 unrouted)
  Top 0.711: 19.56,5.2 34.92,5.2
  Top 0.813: X1.12 14.48,3.21 19.56,5.2 | 34.92,5.2 49.72,5.2 49.72,5.19 52.2,7.66 55.24,7.66 LED1.K 2.2
  Bottom 0.61: TP16.TP 2.2 | 15.73,3.21 11.18,3.21
N$13  (2 unrouted)
  Top 0.406: 55.83,13.93 55.37,14.11 52.2,14.11 51.69,13.5
  Top 0.61: 55.83,12.74 55.83,13.93 | 51.69,13.5 43.5,13.5 35.38,9.17
  Top 0.711: 35.38,9.17 23,9.17
  Top 0.813: 2.3 55.83,12.74 | 23,9.17 14.32,7.18 X1.11
  Bottom 0.61: TP17.TP 2.3 | 15.76,7.18 X1.11
N$14  (2 unrouted)
  Top 0.406: 51.82,15.28 52.07,14.92 55.5,14.92 55.82,16.23
  Top 0.61: 36.7,13.11 41.02,15.28 51.82,15.28
  Top 0.711: 29.4,13.11 36.7,13.11
  Top 0.813: X1.10 10.69,11.15 28.13,11.15 29.4,13.11 | 55.82,16.23 63.07,16.25 2.4
  Bottom 0.61: TP18.TP 65.17,16.23 2.4 | 15.54,11.15 11.18,11.15 11.16,11.14 X1.10
N$15  (via drill 0.6)
  Top 0.711: 37.08,32.91 30.16,32.91
  Top 0.813: IC4.1 38.61,32.93 37.08,32.91
  Top 1.016: 30.16,32.91 27.28,32.91 23.88,29.25 23.88,24.54 | 23.88,24.54 22.26,22.92 10.77,22.92 X1.7 | 23.88,24.54 23.88,23.15 v23.37,22.65
  Bottom 0.61: R18.1 40.49,36.77 IC4.1 | v23.37,22.65 24.77,22.65 R5.2
N$16  (via drill 0.6)
  Top 0.406: v38.48,19.34 36.2,19.34 v35.81,18.96
  Bottom 0.406: 42.04,6.14 42.04,4.87 IC7.8 | 42.04,6.14 IC7.6 | 42.04,6.14 42.04,7.41 41.76,7.79 41.76,13.25 40,15.28 40,15.79 38.48,17.31 v38.48,19.34 | v35.81,18.96 35.69,18.71 35.38,18 34.44,17.06 29.97,17.06 27.96,17.03 C5.1 27.69,21.44 R5.1
N$17  (via drill 0.6)  (1 unrouted)
  Top 0.406: 22.1,51.16 36.13,51.16 42.8,46.08 60.83,46.08 | v71.95,44.17 68.45,46.71 61.79,46.71
  Top 0.61: X1.2 10.76,42.9 13.84,42.9 22.1,51.16 | 60.83,46.08 61.79,46.71 | X3.4 68.45,48.94 68.45,46.71
  Bottom 0.406: IC3.12 77.66,41.31 77.03,41 75.44,41 72.58,42.59 v71.95,44.17 | 10.59,42.9 13.4,42.9 R29.1
N$18
  Bottom 0.406: IC3.15 81.79,45.12 82.68,44.11 82.68,34.84 83.44,34.08 83.44,24.8 84.58,23.28 IC6.5
N$19  (2 unrouted)
  Top 0.61: 57.02,40.05 57.98,38.77 59.25,38.77 59.88,38.14 60.39,37.76 63.18,34.9 63.18,31.54 | 64.15,30.52 2.8
  Top 0.813: X1.14 36.47,42.82 39.24,40.05 57.02,40.05 | 63.18,31.54 64.15,30.52
  Bottom 0.406: 62.27,30.69 61.93,31.2 55.82,31.16
  Bottom 0.61: LED7.K 55.75,32.19
  Bottom 1.016: 2.8 TP23.TP 62.27,30.69
N$20  (via drill 0.81)  (1 unrouted)
  Top 0.813: X1.17 34.12,30.94 35.43,30.65 46.61,30.65 47.75,32.3 47.75,34.2 48.77,34.97 v51.31,34.97
  Bottom 0.813: v51.31,34.97 51.31,36.73
  Bottom 1.016: 1.9 68.08,33.75 TP9.TP 63.83,34.19 62.1,35.6 57.66,35.6 56.77,34.97 v51.31,34.97
N$21  (via drill 0.6)  (1 unrouted)
  Top 0.61: X1.19 47.55,23.02 | 47.56,23.03 51.5,27.09 v51.5,29.31
  Bottom 0.61: v51.5,29.31 49.72,29.31 49.02,29.88 49.09,40.05 D11.1
  Bottom 0.813: 53.78,43.6 51.27,42.04 D11.1
  Bottom 1.016: 53.78,43.6 60.51,43.6 63.06,41 TP11.TP 67.82,40.68 69.69,40.68 1.11
N$22
  Bottom 0.813: D10.2 56.05,38.77 D11.2
  Bottom 1.016: 1.10 TP10.TP 70.87,36.62 69.48,38.01 67.5,39.09 62.74,39.09 62.42,38.77 56.05,38.77
N$23
  Bottom 0.406: R1.2 28.96,10.9 28.96,10.96
  Bottom 0.61: 28.96,10.96 32.37,10.96 X1.22
N$24
  Bottom 0.406: IC7.10 38.73,7.41 35.05,5.25 C1B.1 R1.1
N$25
  Bottom 0.406: IC6.13 76.84,24.55
  Bottom 0.61: TP6.TP 75.92,23.22 1.6 76.84,24.55
N$26
  Bottom 0.406: 73.66,26.75 1.7 | IC6.14 75.4,25.82
  Bottom 0.61: TP7.TP 70.36,26.84 1.7 | 75.4,25.82 73.66,26.75
N$27  (via drill 0.6)  (1 unrouted)
  Top 0.406: 65.91,33.44 65.02,34.33 62.36,37.12 61.85,38.39 | 55.82,18.14 54.99,17.59 52.32,17.59 51.31,16.55 | v36.7,16.3 37.47,16.55 37.46,16.56
  Top 0.508: 65.91,33.44 65.91,33.06 | 61.59,18.14 55.82,18.14 | 51.31,16.55 38.73,16.55 37.46,16.56
  Top 0.61: 61.59,18.14 66.29,18.9 67.69,22.52 67.69,24.04 64.9,25.82 64.9,27.34 67.18,28.36 67.82,29.38 67.82,31.16 65.91,33.06 v65.28,32.42 | 2.11 59.65,40.59 61.85,38.39
  Bottom 0.406: TP26.TP 67.82,31.66 66.29,32.42 | R3.1 v36.7,16.3
  Bottom 0.61: 66.23,32.42 v65.28,32.42
N$28
  Bottom 0.61: J1.1 62.61,46.79 2.12
N$29
  Bottom 0.61: IC4.2 43.05,37.15 R18.2
N$30
  Bottom 0.406: R7.1 R8.2 36.96,4.99 38.87,6.14 IC7.9
N$31
  Bottom 0.406: R9.2 37.08,17.44 39.12,15.41 39.12,13.31 IC7.14
N$33
  Bottom 0.61: 81.03,6.39 81.79,6.39 82.55,5.63
N$34
  Bottom 0.61: LED6.K 53.19,26.62 R4.1
N$35
  Bottom 0.61: 45.59,30.27 Q2.3
  Bottom 0.813: IC4.3 45.59,30.27
N$36
  Bottom 0.406: R9.1 38.1,25.44 41.78,26.96 Q2.1
N$37  (via drill 0.6)
  Top 0.406: 83.31,45.25 v83.31,21.25
  Top 0.61: v83.31,47.03 83.31,45.25
  Bottom 0.406: IC3.2 84.65,45.12 v83.31,47.03 | IC6.7 83.82,20.74 v83.31,21.25
N$38
  Bottom 0.406: 1.3 70.48,12.75 71.5,13.26 71.5,17.06 72.9,18.45 73.28,18.45 74.42,19.6 76.58,19.6 78.74,22.01 IC6.11
  Bottom 0.61: TP3.TP 70.68,12.52 1.3
N$39
  Bottom 0.406: 1.5 73.04,19.75 74.16,20.87 76.45,20.87 77.72,22.14 78.36,22.9 78.74,23.28 IC6.12
  Bottom 0.61: 1.5 70.45,21.4 TP5.TP
N$40
  Bottom 0.406: R7.2 43.56,2.2 | 43.56,2.2 43.56,4.74 44.64,4.74 IC7.7 | 43.56,2.2 R6.1
N$41
  Top 0.508: 57.28,25.57 57.28,27.6
  Top 0.61: LED1.A LED2.A | LED4.A LED5.A 55.24,24.68 56.77,25.19 57.28,25.57 | 57.28,27.6 56.39,28.74 54.85,28.74 LED7.A
  Bottom 0.61: LED1.A 53.34,8.93 52.83,8.42 51.25,8.42 R11.1 | LED2.A LED3.A LED4.A
N$42
  Bottom 0.61: X1.16 35.37,34.9 37.34,36.87 37.34,38.77 38.73,40.17 44.2,40.17 ZüNDSPULE.TP
N$43
  Bottom 0.61: Q3.1 26.24,34.41 27.56,39.28 R13.2
N$44
  Bottom 0.406: IC6.2 IC6.1 86.51,28.77 86.49,30.65 86.49,32.55 83.57,35.35 83.57,42.97 84.45,43.85 IC3.3
N$45
  Bottom 0.406: R12.2 R10.1 44.58,19.75 C2.1
N$46
  Bottom 0.406: IC7.5 43.54,7.41 42.54,8.66 42.54,13.76 41.02,16.29 R12.1 40.26,20.77 C3.1
N$47
  Bottom 0.406: IC7.4 R15.1 49.53,9.31 49.53,12.36 50.29,12.87 R16.2 R17.2
N$48
  Bottom 0.406: IC7.13 38.55,11.34 38.48,11.34 37.85,12.23 R3.2 36.13,12.93 33.53,14.52 32.95,14.52 X1.21
N$49
  Bottom 0.406: R17.1 51.05,18.2 D8.+
N$50  (via drill 0.6)
  Top 0.406: v85.09,31.92 85.15,31.66 85.2,31.97
  Top 0.61: 85.2,31.97 85.22,33.63 85.22,47.79 v85.6,48.3
  Bottom 0.406: IC6.4 84.77,24.55 84.33,25.19 84.33,31.09 v85.09,31.92
  Bottom 0.61: v85.6,48.3 85.6,46.4 IC3.1
N$52
  Bottom 0.406: 76,30.2 1.8 76.82,27.09 IC6.15
  Bottom 0.61: TP8.TP 75.9,30.2 1.8
N$53  (via drill 0.6)
  Top 0.813: X1.15 36.07,38.46 54.4,38.46 57.66,37.19 v58.29,37.19
  Bottom 0.61: TP25.TP 65.09,37.19
  Bottom 0.813: v58.29,37.19 65.09,37.19 2.10
N$54  (1 unrouted)
  Bottom 0.711: 13.72,17.06 6.29,17.06
  Bottom 1.016: 20.21,16.66 19.05,17.82 14.48,17.82 13.72,17.06
  Bottom 1.27: 6.29,17.06 2.54,14.52 R27.1
N$55  (1 unrouted)
  Top 0.406: LED4.K 54.67,18.43 52.45,18.43 52.07,18.71 | 34.96,17.03 28.92,17.03 28.7,17.06
  Top 0.61: 2.5 LED4.K | 52.07,18.71 41.81,18.71 40,17.95 36.83,17.95 35.15,17.03 34.96,17.03 | X1.9 10.81,14.96 14.48,14.96 19.3,17.06 28.7,17.06
  Bottom 0.61: TP19.TP 57.02,18.86 57.91,19.75 2.5 | 15.55,15.1 X1.9
N$56  (1 unrouted)
  Bottom 0.406: IC3.14 81.15,43.85 81.79,43.22 81.79,34.33 82.55,33.44 82.55,24.3 84.45,22.01 86.23,22.01
N$57  (via drill 0.6)  (2 unrouted)
  Top 0.61: X2.2 v83.38,9.25 84.96,9.25
  Bottom 0.61: T13.1 63.14,-1 | 82.42,-1.17 73.53,-1.23 73.3,-1 T14.1 73.38,-1.23 69.09,-1.23 | 69.09,1.63 T13.2 T13.1 | 69.09,-1.23 63.04,-1.23 T13.1 | 69.09,-1.23 69.09,0.67 | T1.2 81.79,14.9 81.53,13.38 | 81.53,13.38 T1.6 | T1.4 83.57,11.85 81.73,12.17 | 81.73,12.17 81.53,13.38 | 81.73,12.17 v83.38,9.25 83.06,8.93 | X2.2 83.06,8.93 | 83.06,8.93 84.9,8.93 R38.1
N$58
  Top 0.61: X1.24 29.34,3.22 TACHO_BELEUCHTUNG.TP
N$59  (1 unrouted)
  Bottom 0.61: T14.2 79.57,1.63 | TP2.TP 76.58,8.42 76.58,9.05 1.2 75.95,12.49 78.49,15.03 79.63,15.03 79.63,16.42 T1.8
N$60
  Top 0.61: 2.6 LED5.K
  Bottom 0.406: D8.- 49.01,19.54 49.07,15.41 48.26,14.26 47.12,12.87 47.12,11.85 46.35,11.22 IC7.2 | 55.88,22.39 55.37,21.88 52.83,21.88 51.43,22.77 49.02,22.77 48.26,22.01 48.26,20.69
  Bottom 0.61: TP21.TP 65.19,23.22 2.6 | LED5.K 55.88,22.39 | 48.26,20.69 D8.-
N$61  (1 unrouted)
  Bottom 0.406: 86.11,25.82 87.95,25.82 87.95,32.3 84.4,35.79 84.4,40.05 IC3.6
N$67
  Bottom 0.406: IC6.10 78.74,20.74 77.72,19.47 77.72,18.03 1.4
  Bottom 0.61: TP4.TP 75.93,16.23 1.4
N$69
  Top 1.016: X1.1 8.38,46.71 6.92,44.87 6.92,1.75 8.13,0.55 | 8.06,0.55 8.13,0.55 | 8.13,0.55 36,0.55 39.24,2.01 58.17,1.88 60.39,3.53 65.05,3.53 1.1
  Bottom 0.61: TP1.TP 1.1
N$580  (1 unrouted)
  Bottom 0.406: 44.7,12.49 45.72,13.5 45.72,14.71 R19.2 46.99,16.42 R10.2
VCC  (via drill 0.6)  (1 unrouted)
  Top 0.61: v48.39,6.9 v48.39,11.98
  Bottom 0.406: R19.1 43.5,14.71 43.33,13.63 43.33,10.45 43.56,9.95 IC7.3 47.37,9.95 47.88,10.45 47.95,10.45 R15.2
  Bottom 0.61: v48.39,11.98 R15.2 | R6.2 47.62,3.85 | C4.1 50.8,6.46 R11.2
  Bottom 0.813: IC1.OUT 52.96,6.14 52.32,5.5 49.78,5.5 49.53,5.76 | 49.53,5.76 v48.39,6.9 | 47.62,3.85 49.53,5.76

### Text on the board
Top: top | Brotbox V2.1 / maru-labs.com
tPlace: QC
bPlace: G5 | G4 | G3 | G1 | G2
tNames: GND c b a 12V(rt) | Zünd | cut here | 18 | 19 | 2.7 / 2.6 | 8 | 1.12 / 1.11 / 1.1 / 1.9 / 1.8 / 1.7 / 1.6 / 1.5 / 1.4 / 1.3 | 1.2 | 1.1 | 1 / 2 / 3 / 4 / 5 / 6 / 7 / / 9 / 10 / 11 / 12 | 2.12 / 2.11 / 2.1 / 2.9 / / / / 2.5 / 2.4 / 2.3 / 2.2 / 2.1 | 13 / 14 / 15 / 16 / 17 / / / 20 / 21 / 22 / 23 / 24
bNames: N
tStop: Brotbox V2.0 / www.flyingbrick.de
tDocu: +12v